# EAGLE board lpc1788_board (EAGLE 6.6.0)
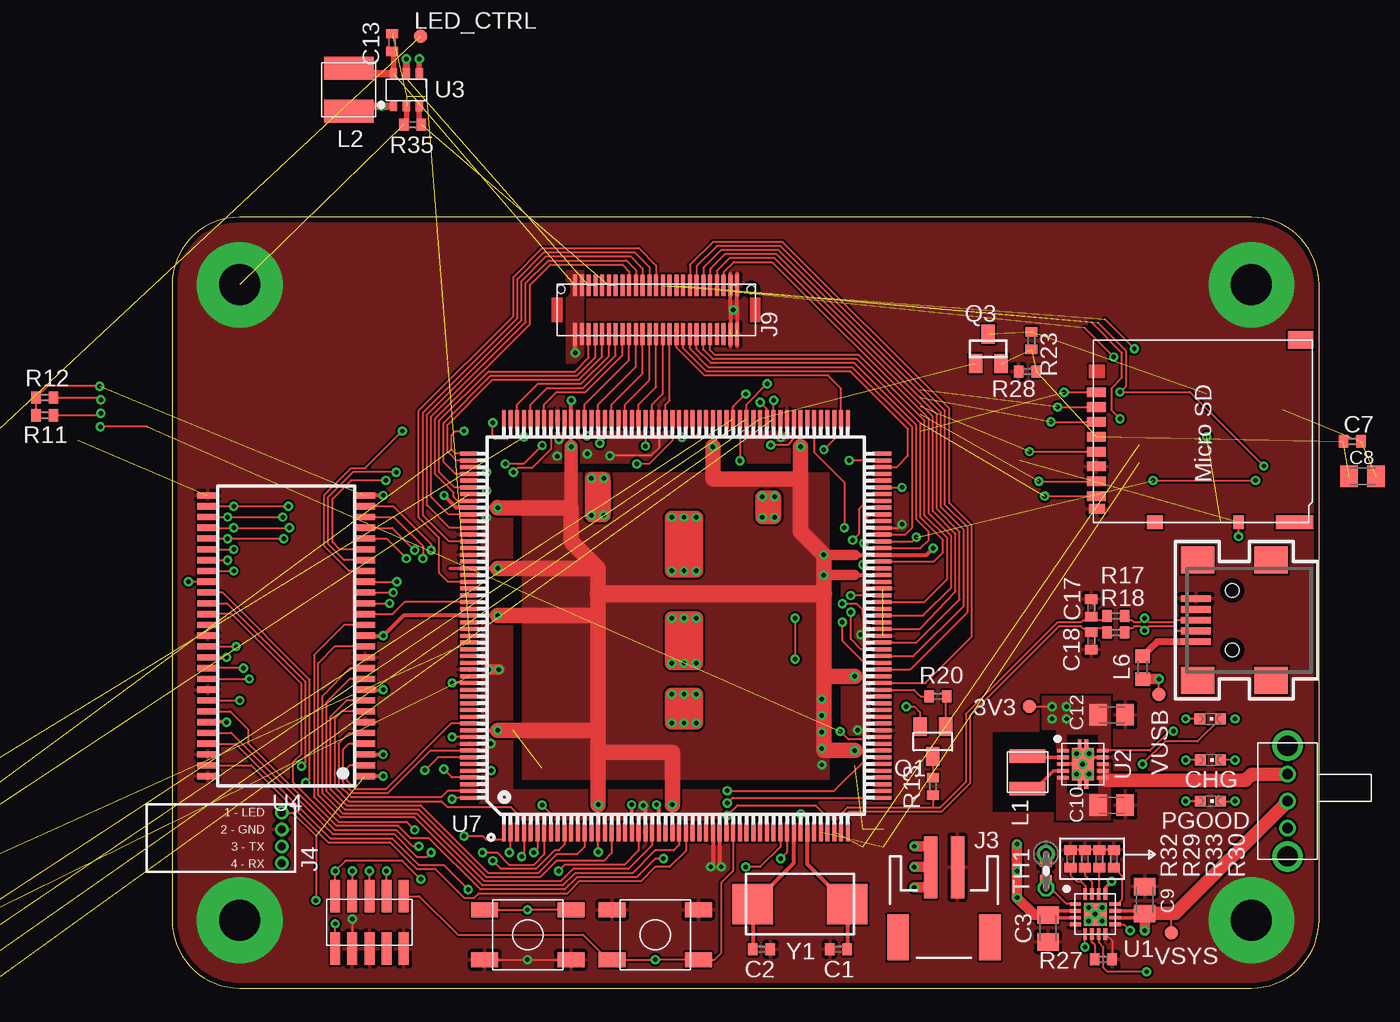
[diagram p5: board, top side]
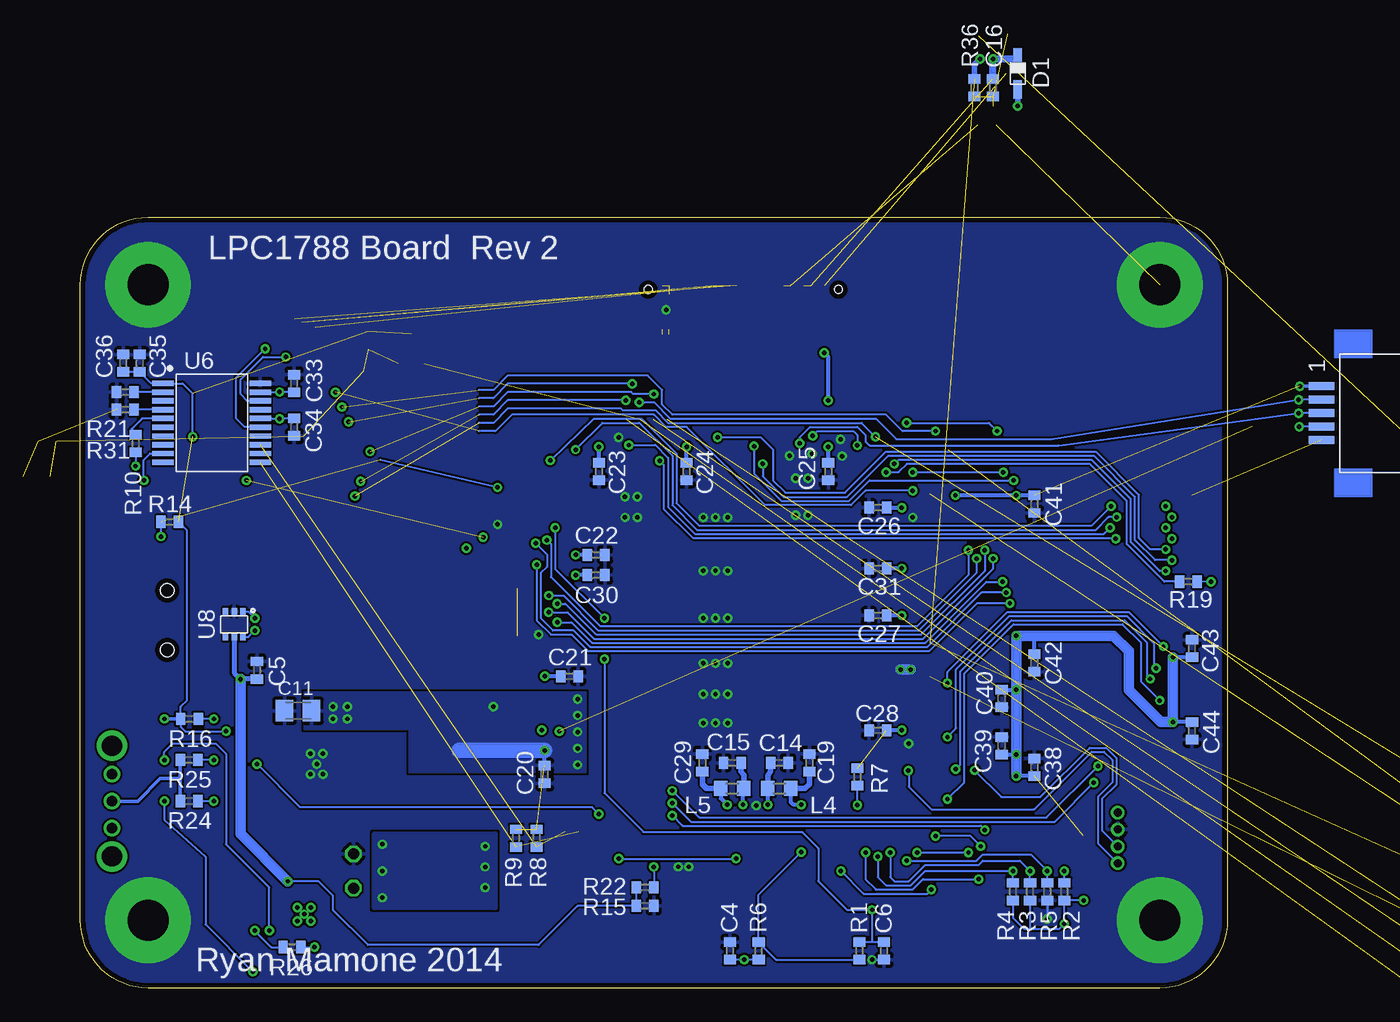
[diagram p6: board, bottom side, seen from below]

Size 85.01 x 57.15 mm. Coordinates in mm from the lower left corner, seen from the top.
Outline: 5.01,57.15 arc90 0,52.15 0,5.05 arc90 5.01,0 80.01,0 arc90 85.01,5.05 85.01,52.15 arc90 80.01,57.15 5.01,57.15
Copper layers (1*16): Top 0.0356mm / dielectric 1.5011mm / Bottom 0.0356mm
Design rules "LaenPCBOrder_tented_vias": minimum track width 6mil, minimum drill 13mil, track to track 6mil, track to pad 6mil, pad to pad 6mil, via to via 6mil, smd to smd 6mil, copper to edge 15mil, drill to drill 6mil, minimum pad ring 7mil, minimum via ring 7mil, stop-mask expansion 4mil, vias tented up to drill 13mil, thermal gap 10mil

## Footprints (pad centres in the part's own frame; a part is rotated, then mirrored left to right if it is on the bottom)
TP10R = smd 1 x 1: TP 0,0
C0402 = smd 0.7 x 0.9: 1 -0.65,0; 2 0.65,0
C0805K = smd 1.3 x 1.6: 1 -1,0; 2 1,0
CHIPLED_0603 = smd 0.8 x 0.8: A 0,-0.75; C 0,0.75
SOD-323 = smd 1.35 x 0.65: A 1.2,0; C -1.2,0
MUSB-05-X-B-SM-A = smd 0.5 x 2.25: 1 -1.6,8.545; 2 -0.8,8.545; 3 0,8.545; 4 0.8,8.545; 5 1.6,8.545 | smd 2 x 2.5: 8 -4.45,2.97; 9 4.45,2.97; 10 -4.45,8.42; 11 4.45,8.42 | hole 1: -2.2,5.85; 2.2,5.85
JST_2MM_SMT = smd 1 x 4.6: 1 -1,-2.43; 2 1,-2.43 | smd 1.6 x 3.4: NC1 -3.4,2.77; NC2 3.4,2.77
4-PIN_1.25MM = drill 0.6 pad 1: 1 1.875,0; 2 0.625,0; 3 -0.625,0; 4 -1.875,0
10-PIN_5X2_.050IN_SMT = smd 2.4 x 0.74: P$1 -1.95,2.54; P$2 1.95,2.54; P$3 -1.95,1.27; P$4 1.95,1.27; P$5 -1.95,0; P$6 1.95,0; P$7 -1.95,-1.27; P$8 1.95,-1.27; P$9 -1.95,-2.54; P$10 1.95,-2.54
DF12B-50DX_25X2_0.5MM = smd 0.3 x 1.6: P$1 -6,-1.8; P$2 -6,1.8; P$3 -5.5,-1.8; P$4 -5.5,1.8; P$5 -5,-1.8; P$6 -5,1.8; P$7 -4.5,-1.8; P$8 -4.5,1.8; P$9 -4,-1.8; P$10 -4,1.8; P$11 -3.5,-1.8; P$12 -3.5,1.8; P$13 -3,-1.8; P$14 -3,1.8; P$15 -2.5,-1.8; P$16 -2.5,1.8; P$17 -2,-1.8; P$18 -2,1.8; P$19 -1.5,-1.8; P$20 -1.5,1.8; P$21 -1,-1.8; P$22 -1,1.8; P$23 -0.5,-1.8; P$24 -0.5,1.8; P$25 0,-1.8; P$26 0,1.8; P$27 0.5,-1.8; P$28 0.5,1.8; P$29 1,-1.8; P$30 1,1.8; P$31 1.5,-1.8; P$32 1.5,1.8; P$33 2,-1.8; P$34 2,1.8; P$35 2.5,-1.8; P$36 2.5,1.8; P$37 3,-1.8; P$38 3,1.8; P$39 3.5,-1.8; P$40 3.5,1.8; P$41 4,-1.8; P$42 4,1.8; P$43 4.5,-1.8; P$44 4.5,1.8; P$45 5,-1.8; P$46 5,1.8; P$47 5.5,-1.8; P$48 5.5,1.8; P$49 6,-1.8; P$50 6,1.8 | hole 0.6: -7.05,1.5; 7.05,1.5
MOLEX_527930570 = smd 0.6 x 1.9: P$1 -2,0; P$2 -1,0; P$3 0,0; P$4 1,0; P$5 2,0
3015 = smd 1 x 2.7: 1 -1.2,0; 2 1.2,0
4012 = smd 1.7 x 3.7: 1 -1.6,0; 2 1.6,0
0603 = smd 1 x 1.1: 1 -0.85,0; 2 0.85,0
OS102011MA1QS1 = drill 1.5: CASE@1 -4.1,0; CASE@2 4.1,0 | drill 0.8: P$1 -2,0; P$2 0,0; P$3 2,0
SOT23 = smd 1 x 1.4: 1 -0.95,-1.1; 2 0.95,-1.1; 3 0,1.1
SUPER-SOT3 = smd 1 x 1.4: 1 -0.95,-1.1; 2 0.95,-1.1; 3 0,1.1
R0402 = smd 0.7 x 0.9: 1 -0.65,0; 2 0.65,0
SMT_PUSHBUTTON = smd 2 x 1.1: P$1 -3.2,1.85; P$2 3.2,1.85; P$3 -3.2,-1.85; P$4 3.2,-1.85
0204V = drill 0.813 octagon: 1 -1.27,0; 2 1.27,0
QFN-16 = smd 0.85 x 0.28: 1 -1.475,0.75; 2 -1.475,0.25; 3 -1.475,-0.25; 4 -1.475,-0.75; 9 1.475,-0.75; 10 1.475,-0.25; 11 1.475,0.25; 12 1.475,0.75 | smd 0.28 x 0.85: 5 -0.75,-1.475; 6 -0.25,-1.475; 7 0.25,-1.475; 8 0.75,-1.475; 13 0.75,1.475; 14 0.25,1.475; 15 -0.25,1.475; 16 -0.75,1.475 | smd 1.7 x 1.7: PAD 0,0 | drill 0.33 pad 0.33: PAD@1 -0.5,0.5; PAD@2 0.5,0.5; PAD@3 0,0; PAD@4 -0.5,-0.5; PAD@5 0.5,-0.5
QFN-10 = smd 0.28 x 0.85: 1 -1,-1.475; 2 -0.5,-1.475; 3 0,-1.475; 4 0.5,-1.475; 5 1,-1.475; 6 1,1.475; 7 0.5,1.475; 8 0,1.475; 9 -0.5,1.475; 10 -1,1.475 | smd 2.4 x 1.65: PAD@1 0,0 | smd 0.7 x 0.28: PAD@2 -1.5,0.25; PAD@3 -1.5,-0.25; PAD@4 1.5,0.25; PAD@5 1.5,-0.25
SOT-26 = smd 0.55 x 0.8: 1 -0.95,-1.2; 2 0,-1.2; 3 0.95,-1.2; 4 0.95,1.2; 5 0,1.2; 6 -0.95,1.2
TSOP54-II = smd 1.51 x 0.458: P$1 -5.835,10.4; P$2 -5.835,9.6; P$3 -5.835,8.8; P$4 -5.835,8; P$5 -5.835,7.2; P$6 -5.835,6.4; P$7 -5.835,5.6; P$8 -5.835,4.8; P$9 -5.835,4; P$10 -5.835,3.2; P$11 -5.835,2.4; P$12 -5.835,1.6; P$13 -5.835,0.8; P$14 -5.835,0; P$15 -5.835,-0.8; P$16 -5.835,-1.6; P$17 -5.835,-2.4; P$18 -5.835,-3.2; P$19 -5.835,-4; P$20 -5.835,-4.8; P$21 -5.835,-5.6; P$22 -5.835,-6.4; P$23 -5.835,-7.2; P$24 -5.835,-8; P$25 -5.835,-8.8; P$26 -5.835,-9.6; P$27 -5.835,-10.4; P$28 5.835,-10.4; P$29 5.835,-9.6; P$30 5.835,-8.8; P$31 5.835,-8; P$32 5.835,-7.2; P$33 5.835,-6.4; P$34 5.835,-5.6; P$35 5.835,-4.8; P$36 5.835,-4; P$37 5.835,-3.2; P$38 5.835,-2.4; P$39 5.835,-1.6; P$40 5.835,-0.8; P$41 5.835,0; P$42 5.835,0.8; P$43 5.835,1.6; P$44 5.835,2.4; P$45 5.835,3.2; P$46 5.835,4; P$47 5.835,4.8; P$48 5.835,5.6; P$49 5.835,6.4; P$50 5.835,7.2; P$51 5.835,8; P$52 5.835,8.8; P$53 5.835,9.6; P$54 5.835,10.4
SSOP-20 = smd 1.6 x 0.4: P$1 -3.6,2.925; P$2 -3.6,2.275; P$3 -3.6,1.625; P$4 -3.6,0.975; P$5 -3.6,0.325; P$6 -3.6,-0.325; P$7 -3.6,-0.975; P$8 -3.6,-1.625; P$9 -3.6,-2.275; P$10 -3.6,-2.925; P$11 3.6,-2.925; P$12 3.6,-2.275; P$13 3.6,-1.625; P$14 3.6,-0.975; P$15 3.6,-0.325; P$16 3.6,0.325; P$17 3.6,0.975; P$18 3.6,1.625; P$19 3.6,2.275; P$20 3.6,2.925
LQFP208 = smd 1.4 x 0.29: 1 -15.3,12.75; 2 -15.3,12.25; 3 -15.3,11.75; 4 -15.3,11.25; 5 -15.3,10.75; 6 -15.3,10.25; 7 -15.3,9.75; 8 -15.3,9.25; 9 -15.3,8.75; 10 -15.3,8.25; 11 -15.3,7.75; 12 -15.3,7.25; 13 -15.3,6.75; 14 -15.3,6.25; 15 -15.3,5.75; 16 -15.3,5.25; 17 -15.3,4.75; 18 -15.3,4.25; 19 -15.3,3.75; 20 -15.3,3.25; 21 -15.3,2.75; 22 -15.3,2.25; 23 -15.3,1.75; 24 -15.3,1.25; 25 -15.3,0.75; 26 -15.3,0.25; 27 -15.3,-0.25; 28 -15.3,-0.75; 29 -15.3,-1.25; 30 -15.3,-1.75; 31 -15.3,-2.25; 32 -15.3,-2.75; 33 -15.3,-3.25; 34 -15.3,-3.75; 35 -15.3,-4.25; 36 -15.3,-4.75; 37 -15.3,-5.25; 38 -15.3,-5.75; 39 -15.3,-6.25; 40 -15.3,-6.75; 41 -15.3,-7.25; 42 -15.3,-7.75; 43 -15.3,-8.25; 44 -15.3,-8.75; 45 -15.3,-9.25; 46 -15.3,-9.75; 47 -15.3,-10.25; 48 -15.3,-10.75; 49 -15.3,-11.25; 50 -15.3,-11.75; 51 -15.3,-12.25; 52 -15.3,-12.75; 105 15.3,-12.75; 106 15.3,-12.25; 107 15.3,-11.75; 108 15.3,-11.25; 109 15.3,-10.75; 110 15.3,-10.25; 111 15.3,-9.75; 112 15.3,-9.25; 113 15.3,-8.75; 114 15.3,-8.25; 115 15.3,-7.75; 116 15.3,-7.25; 117 15.3,-6.75; 118 15.3,-6.25; 119 15.3,-5.75; 120 15.3,-5.25; 121 15.3,-4.75; 122 15.3,-4.25; 123 15.3,-3.75; 124 15.3,-3.25; 125 15.3,-2.75; 126 15.3,-2.25; 127 15.3,-1.75; 128 15.3,-1.25; 129 15.3,-0.75; 130 15.3,-0.25; 131 15.3,0.25; 132 15.3,0.75; 133 15.3,1.25; 134 15.3,1.75; 135 15.3,2.25; 136 15.3,2.75; 137 15.3,3.25; 138 15.3,3.75; 139 15.3,4.25; 140 15.3,4.75; 141 15.3,5.25; 142 15.3,5.75; 143 15.3,6.25; 144 15.3,6.75; 145 15.3,7.25; 146 15.3,7.75; 147 15.3,8.25; 148 15.3,8.75; 149 15.3,9.25; 150 15.3,9.75; 151 15.3,10.25; 152 15.3,10.75; 153 15.3,11.25; 154 15.3,11.75; 155 15.3,12.25; 156 15.3,12.75 | smd 0.29 x 1.4: 53 -12.75,-15.3; 54 -12.25,-15.3; 55 -11.75,-15.3; 56 -11.25,-15.3; 57 -10.75,-15.3; 58 -10.25,-15.3; 59 -9.75,-15.3; 60 -9.25,-15.3; 61 -8.75,-15.3; 62 -8.25,-15.3; 63 -7.75,-15.3; 64 -7.25,-15.3; 65 -6.75,-15.3; 66 -6.25,-15.3; 67 -5.75,-15.3; 68 -5.25,-15.3; 69 -4.75,-15.3; 70 -4.25,-15.3; 71 -3.75,-15.3; 72 -3.25,-15.3; 73 -2.75,-15.3; 74 -2.25,-15.3; 75 -1.75,-15.3; 76 -1.25,-15.3; 77 -0.75,-15.3; 78 -0.25,-15.3; 79 0.25,-15.3; 80 0.75,-15.3; 81 1.25,-15.3; 82 1.75,-15.3; 83 2.25,-15.3; 84 2.75,-15.3; 85 3.25,-15.3; 86 3.75,-15.3; 87 4.25,-15.3; 88 4.75,-15.3; 89 5.25,-15.3; 90 5.75,-15.3; 91 6.25,-15.3; 92 6.75,-15.3; 93 7.25,-15.3; 94 7.75,-15.3; 95 8.25,-15.3; 96 8.75,-15.3; 97 9.25,-15.3; 98 9.75,-15.3; 99 10.25,-15.3; 100 10.75,-15.3; 101 11.25,-15.3; 102 11.75,-15.3; 103 12.25,-15.3; 104 12.75,-15.3; 157 12.75,15.3; 158 12.25,15.3; 159 11.75,15.3; 160 11.25,15.3; 161 10.75,15.3; 162 10.25,15.3; 163 9.75,15.3; 164 9.25,15.3; 165 8.75,15.3; 166 8.25,15.3; 167 7.75,15.3; 168 7.25,15.3; 169 6.75,15.3; 170 6.25,15.3; 171 5.75,15.3; 172 5.25,15.3; 173 4.75,15.3; 174 4.25,15.3; 175 3.75,15.3; 176 3.25,15.3; 177 2.75,15.3; 178 2.25,15.3; 179 1.75,15.3; 180 1.25,15.3; 181 0.75,15.3; 182 0.25,15.3; 183 -0.25,15.3; 184 -0.75,15.3; 185 -1.25,15.3; 186 -1.75,15.3; 187 -2.25,15.3; 188 -2.75,15.3; 189 -3.25,15.3; 190 -3.75,15.3; 191 -4.25,15.3; 192 -4.75,15.3; 193 -5.25,15.3; 194 -5.75,15.3; 195 -6.25,15.3; 196 -6.75,15.3; 197 -7.25,15.3; 198 -7.75,15.3; 199 -8.25,15.3; 200 -8.75,15.3; 201 -9.25,15.3; 202 -9.75,15.3; 203 -10.25,15.3; 204 -10.75,15.3; 205 -11.25,15.3; 206 -11.75,15.3; 207 -12.25,15.3; 208 -12.75,15.3
SC-88 = smd 0.5 x 0.4: P$1 -0.95,0.65; P$2 -0.95,0; P$3 -0.95,-0.65; P$4 0.95,-0.65; P$5 0.95,0; P$6 0.95,0.65
DM3AT = smd 1 x 1.2: CASE -6.785,2.28 | smd 1 x 2.8: CASE@1 -6.785,-8.07 | smd 1.3 x 1.9: CASE@2 6.715,-8.52 | smd 0.711 x 1.422: CD/DAT3 1.74,6.63; CLK -1.56,6.63; CMD 0.64,6.63; DAT0 -3.76,6.63; DAT1 -4.86,6.63; DAT2 2.84,6.63; VDD -0.46,6.63; VSS -2.66,6.63 | smd 1 x 0.8: DET_A -6.785,-3.92 | smd 0.7 x 1.2: DET_B -5.81,6.58
2-SMD_8MMX4.5MM = smd 3 x 3: 1 -3.5,0; 2 3.5,0

## Placement (x,y rotation side)
3V3  TPTP10R  [TP10R]  63.55,20.88 0 top
C1  18pF  [C0402]  49.4,2.9 180 top
C2  18pF  [C0402]  43.7,2.9 0 top
C3  10uF  [C0805K]  64.92,4.43 270 top
C4  0.1uF  [C0402]  36.88,2.76 90 bottom
C5  1uF  [C0402]  71.93,23.57 90 bottom
C6  0.1uF  [C0402]  25.45,2.76 270 bottom
C7  0.1uF  [C0402]  87.48,40.54 0 top
C8  10uF  [C0805K]  88.24,37.95 0 top
C9  10uF  [C0805K]  72.09,6.54 90 top
C10  10uF  [C0805K]  69.65,13.56 0 top
C11  10uF  [C0805K]  68.88,20.57 180 bottom
C12  10uF  [C0805K]  69.65,20.27 0 top
C13  1uF  [C0402]  16.31,70.1 90 top  (outside the outline)
C14  0.1uF  [C0402]  33.21,16.71 0 bottom
C15  0.1uF  [C0402]  36.7,16.71 180 bottom
C16  1uF  [C0402]  17.37,66.75 270 bottom  (outside the outline)
C17  18pF  [C0402]  68.12,28.19 90 top
C18  18pF  [C0402]  68.12,25.76 270 top
C19  0.1uF  [C0402]  30.99,16.71 90 bottom
C20  0.1uF  [C0402]  50.61,15.85 270 bottom
C21  0.1uF  [C0402]  48.77,23.12 0 bottom
C22  0.1uF  [C0402]  46.79,32.12 0 bottom
C23  0.1uF  [C0402]  46.59,38.3 270 bottom
C24  0.1uF  [C0402]  40.09,38.3 270 bottom
C25  0.1uF  [C0402]  29.59,38.3 270 bottom
C26  0.1uF  [C0402]  25.91,35.62 180 bottom
C27  0.1uF  [C0402]  25.91,27.62 180 bottom
C28  0.1uF  [C0402]  25.91,19.12 180 bottom
C29  0.1uF  [C0402]  38.93,16.71 90 bottom
C30  0.1uF  [C0402]  46.79,30.62 0 bottom
C31  0.1uF  [C0402]  25.91,31.12 180 bottom
C33  0.01uF  [C0402]  69.18,44.84 90 bottom
C34  0.01uF  [C0402]  69.17,41.59 270 bottom
C35  0.1uF  [C0402]  80.62,46.33 90 bottom
C36  10uF  [C0402]  81.84,46.33 90 bottom
C38  0.1uF  [C0402]  14.3,16.38 90 bottom
C39  0.1uF  [C0402]  16.74,17.98 90 bottom
C40  0.1uF  [C0402]  16.74,21.48 270 bottom
C41  0.1uF  [C0402]  14.3,35.88 270 bottom
C42  0.1uF  [C0402]  14.3,24.11 270 bottom
C43  0.1uF  [C0402]  2.63,25.18 90 bottom
C44  0.1uF  [C0402]  2.63,19.08 270 bottom
CHG  USB  [CHIPLED_0603]  76.96,16.92 270 top
D1  [SOD-323]  15.54,67.82 270 bottom  (outside the outline)
J2  SAMTEC_MUSB  [MUSB-05-X-B-SM-A]  84.43,27.28 90 top
J3  JST_2MM_SMT  [JST_2MM_SMT]  57.22,6.53 180 top
J4  Console  [4-PIN_1.25MM]  8.13,11.14 90 top
J6  JTAG  [10-PIN_5X2_.050IN_SMT]  14.63,4.88 90 top
J9  DF12B-50DX_25X2_0.5MM  [DF12B-50DX_25X2_0.5MM]  35.88,50.29 0 top
J10  MOLEX_527930570_5PIN_FFC_CONNECTOR  [MOLEX_527930570]  -6.97,42.62 270 bottom  (outside the outline)
L1  3.3uH  [3015]  63.4,16 90 top
L2  22uH  [4012]  13.11,66.6 270 top  (outside the outline)
L4  470nH  [0603]  33.21,14.81 180 bottom
L5  470nH  [0603]  36.7,14.81 0 bottom
L6  470nH  [0603]  71.93,23.77 270 top
LED2  USB  [CHIPLED_0603]  76.94,19.96 270 top
LED_CTRL  TPTP10R  [TP10R]  18.44,70.56 0 top  (outside the outline)
PGOOD  USB  [CHIPLED_0603]  76.96,13.87 270 top
PWR  OS102011MA1QS1  [OS102011MA1QS1]  82.69,13.87 90 top
Q1  MMBT2907  [SOT23]  56.39,18.29 180 top
Q3  FDN335N  [SUPER-SOT3]  60.5,47.4 0 top
R1  100K  [R0402]  27.28,2.76 270 bottom
R2  10K  [R0402]  12.09,7.16 270 bottom
R3  10K  [R0402]  14.63,7.16 270 bottom
R4  10K  [R0402]  15.9,7.16 270 bottom
R5  10K  [R0402]  13.36,7.16 90 bottom
R6  100K  [R0402]  34.75,2.76 90 bottom
R7  10K  [R0402]  27.43,15.66 90 bottom
R8  4.7K  [R0402]  51.21,11.13 90 bottom
R9  4.7K  [R0402]  52.73,11.13 90 bottom
R10  20K  [R0402]  80.92,40.39 270 bottom
R11  4.7K  [R0402]  -9.45,42.47 180 top  (outside the outline)
R12  4.7K  [R0402]  -9.45,43.77 180 top  (outside the outline)
R13  1.5K  [R0402]  56.39,14.98 90 top
R14  10K  [R0402]  78.4,34.57 180 bottom
R15  39K  [R0402]  43.17,6.1 180 bottom
R16  50  [R0402]  76.94,19.96 180 bottom
R17  33  [R0402]  69.95,27.58 180 top
R18  33  [R0402]  69.95,26.37 180 top
R19  0  [R0402]  2.89,30.14 0 bottom
R20  22  [R0402]  56.76,21.64 0 top
R21  20K  [R0402]  81.69,44.19 0 bottom
R22  24K  [R0402]  43.17,7.47 180 bottom
R23  0  [R0402]  63.7,48.01 270 top
R24  1.5K  [R0402]  76.96,13.87 180 bottom
R25  1.5K  [R0402]  76.96,16.92 180 bottom
R26  10K  [R0402]  69.34,3.05 0 bottom
R27  10K  [R0402]  69.04,2.13 180 top
R28  10K  [R0402]  63.4,45.72 180 top
R29  3.57K  [R0402]  67.67,9.6 270 top
R30  2.94K  [R0402]  69.8,9.6 270 top
R31  20K  [R0402]  81.69,42.88 0 bottom
R32  4.32K  [R0402]  66.6,9.6 270 top
R33  56.2K  [R0402]  68.73,9.6 270 top
R34  10K  [R0402]  64.77,8.69 90 top
R35  2.5  [R0402]  17.83,64.01 0 top  (outside the outline)
R36  10K  [R0402]  18.75,66.75 90 bottom  (outside the outline)
SW1  Reset  [SMT_PUSHBUTTON]  35.81,3.96 180 top
SW3  ISP  [SMT_PUSHBUTTON]  26.37,3.96 0 top
TH1  [0204V]  64.77,8.69 270 top
TP1  TPTP10R  [TP10R]  -78.18,-36.27 0 top  (outside the outline)
TP2  TPTP10R  [TP10R]  -78.18,-39.62 0 top  (outside the outline)
TP3  TPTP10R  [TP10R]  -78.18,-42.98 0 top  (outside the outline)
TP4  TPTP10R  [TP10R]  -78.18,-19.51 0 top  (outside the outline)
TP5  TPTP10R  [TP10R]  -78.18,-22.86 0 top  (outside the outline)
TP6  TPTP10R  [TP10R]  -78.18,-26.21 0 top  (outside the outline)
TP7  TPTP10R  [TP10R]  -78.18,-29.57 0 top  (outside the outline)
TP8  TPTP10R  [TP10R]  -78.18,-32.92 0 top  (outside the outline)
TP9  TPTP10R  [TP10R]  -78.18,-46.33 0 top  (outside the outline)
TP10  TPTP10R  [TP10R]  -78.18,-49.68 0 top  (outside the outline)
U1  BQ24232H-BATTERY_CHARGER  [QFN-16]  68.43,5.49 0 top
U2  TPS63001-BUCK-BOOST_CONVERTER  [QFN-10]  67.51,16.61 270 top
U3  AP5724  [SOT-26]  17.37,66.6 0 top  (outside the outline)
U4  AS4C8M16S-128MBIT_SDRAM  [TSOP54-II]  8.47,26.13 180 top
U6  AR1021-RESISTIVE_TOUCH_CONTROLLER  [SSOP-20]  75.29,41.91 0 bottom
U7  LPC177X_8X-208  [LQFP208]  37.34,26.87 90 top
U8  NUP2202  [SC-88]  73.61,26.97 270 bottom
U$3  DM3AT  [DM3AT]  75.13,41.34 90 top
VSYS  TPTP10R  [TP10R]  74.07,4.11 0 top
VUSB  TPTP10R  [TP10R]  73.15,21.79 0 top
Y1  12MHz  [2-SMD_8MMX4.5MM]  46.55,6.24 0 top

## Tracks (layer width: path | path; a pad name or v marks a point on that pad's centre or on a via)
!CAS  (via drill 0.33)
  Top 0.152: U7.87 51.48,31.12 v51.21,31.39 | U4.P$17 v16.13,28.53
  Bottom 0.152: v16.13,28.53 18.56,28.53 22.1,24.99 47.4,24.99 48.62,26.21 50.14,26.21 51.21,27.28 v51.21,31.39
!DYCS0  (via drill 0.33)
  Top 0.152: U7.73 51.31,24.12 49.68,25.76 v49.68,27.13 | U4.P$19 v16.66,30.13
  Bottom 0.152: v49.68,27.13 48.62,27.13 47.09,25.6 22.4,25.6 17.88,30.13 v16.66,30.13
!RAS  (via drill 0.33)
  Top 0.152: v51.28,32.99 51.28,34.67 51.73,35.12 U7.95 | U4.P$18 v16.39,29.33
  Bottom 0.152: v51.28,32.99 50.44,32.16 50.44,31.24 50.9,30.79 50.9,27.43 49.99,26.52 48.46,26.52 47.24,25.3 22.25,25.3 18.22,29.33 v16.39,29.33
!WE
  Top 0.152: U7.179 17.25,28.62 16.35,27.73 U4.P$16
+3V3  (via drill 0.33)  (10 unrouted)
  Top 0.152: v-5.37,44.62 -9.22,44.62 R12.2 R11.2 | v31.59,10.1 U7.15 | 48.34,17.63 48.31,17.65 | J6.P$1 v12.09,4.78 | 8.13,13.01 8.94,13.01 10.67,11.28 v10.67,6.51 | v54.41,20.88 55.02,20.88 55.44,20.46 Q1.2 | v74.22,19.05 73.91,19.05 72.48,17.61 U2.10 | 3V3.TP v65.23,20.88
  Top 0.254: 20.61,31.12 U7.174
  Top 0.279: U7.15 v31.59,13.59 | U7.26 v37.08,13.59 | U7.198 v24.13,19.12 | v24.13,27.62 U7.181 17.15,27.62 v15.65,26.13 U4.P$14 | v24.13,31.12 U7.174 | v24.13,35.62 U7.165 21.07,35.62 v20.16,36.53 | v29.59,40.14 U7.146 v29.59,43.56 | v40.09,40.14 U7.125 | v46.59,40.14 U7.112 | v48.31,32.12 U7.89 55.93,32.12 v56.42,32.61 | v48.31,30.62 U7.86 | v50.61,23.12 U7.71 | v50.61,17.62 U7.60 | C38.1 v15.65,15.73 | U4.P$3 v15.65,17.33 | U4.P$9 v15.65,22.13 | C43.1 v4.05,24.53 | v4.05,19.73 C44.1 | v15.65,36.53 C41.1 | v29.88,47.09 J9.P$1
  Top 0.3: U7.26
  Top 0.406: U3.6 16.42,69.34 C13.1
  Top 0.559: U3.6 13.41,67.8
  Top 0.61: 50.6,32.13 v48.31,32.12 | 13.41,67.8 L2.1
  Top 0.762: 50.6,30.63 v48.31,30.62 | v48.31,32.13 50.6,32.13
  Top 1.016: v29.59,40.14 29.59,35.61
  Top 1.143: v37.08,13.59 37.08,17.48 31.59,17.48 | v24.13,19.12 v24.13,19.13 31.59,19.13 | v31.59,13.59 31.59,17.48 | v24.13,35.62 24.14,35.61 29.59,35.61 29.59,33.12 31.59,31.12 | 46.58,37.74 40.13,37.74 40.08,37.8 v40.08,40.13 v40.09,40.14 | 46.58,37.74 46.58,33.86 v48.31,32.13 | v50.61,17.62 48.34,17.62 48.34,17.63 | 46.58,37.74 v46.58,40.14 v46.59,40.14 | v24.13,27.62 31.59,27.62 | v24.13,31.12 31.59,31.12 | 31.59,19.13 31.59,17.48 | 31.59,27.62 31.59,19.13 | 31.59,31.12 31.59,29.26 31.59,27.62 | v50.61,23.12 48.31,23.12 | 48.31,23.12 48.31,17.65 | 48.31,23.12 48.31,29.26 v48.31,30.62 v48.31,32.12
  Top 1.27: 31.59,29.26 48.31,29.26
  Bottom 0.152: C36.1 C35.1 79.78,44.84 U6.P$1 77.45,44.84 76.69,44.08 v76.69,40.88 | R4.2 15.9,5.23 15.09,4.42 14.63,4.42 | 14.63,4.42 12.45,4.42 v12.09,4.78 R2.2 v10.67,6.51 | R3.2 14.63,4.42 | v31.59,10.1 34.75,6.94 R6.2 33.45,2.11 R1.2 | R16.2 77.57,19.98 | 77.57,19.98 77.57,19.36 77.27,19.05 v74.22,19.05 | 77.57,19.98 77.57,20.88 77.11,21.34 77.11,33.94 R14.1
  Bottom 0.254: R16.2 v78.79,19.96 | J10.P$1 v-5.37,44.62
  Bottom 0.279: C38.1 v15.65,15.73 | C39.1 v15.65,17.33 | C40.1 v15.65,22.13 | C42.1 U4.P$14 | C41.1 v15.65,36.53 v20.16,36.53 | C43.1 v4.05,24.53 | C44.1 v4.05,19.73 | v29.59,43.56 29.59,46.8 v29.88,47.09
  Bottom 0.3: v24.13,19.12 C28.1 | 25.25,27.64 C27.1 v24.13,27.62 | v24.13,31.12 C31.1 | C26.1 v24.13,35.62 | C25.1 v29.59,40.14 | C24.1 v40.09,40.14 | C23.1 v46.59,40.14 | C22.1 v48.31,32.12 | C30.1 v48.31,30.62 | C21.1 v50.61,23.12 | C20.1 v50.61,17.62 | L5.1 37.55,14.06 v37.08,13.59 | v31.59,13.59 32.16,13.59 32.36,13.79 L4.1
  Bottom 0.406: L5.1 38.61,14.81 38.92,15.13 C29.1 | L4.1 31.3,14.81 30.99,15.13 C19.1
  Bottom 0.762: v15.65,15.73 v15.65,17.33 v15.65,22.13 v15.65,26.13 U4.P$14 8.45,26.13 7.32,24.99 7.32,22.1 4.95,19.73 v4.05,19.73 v4.05,24.53
  Bottom 1.143: 56.94,17.62 v50.61,17.62
  other vias: 66.29,19.96 66.29,20.88 48.17,21.43 48.17,20.21 48.17,18.99 48.17,17.78 48.17,16.56 65.23,19.96
  pour Top: 25.93,15.42 48.79,15.42 48.79,38.28 25.93,38.28
  cutout Top (rank 2): 39.9,11.3 40.87,11.3 40.87,11.81 39.9,11.81
  pour Top (no thermals): 29.26,53.19 30.48,53.19 30.48,46.86 29.87,46.33 29.26,46.33
  cutout Top (rank 2): 41.27,48.18 41.94,48.18 41.94,48.69 41.27,48.69
  cutout Top (rank 2): 41.27,51.84 41.94,51.84 41.94,52.35 41.27,52.35
  pour Top (rank 2, no thermals): 64.52,21.64 69.55,21.64 69.55,17.51 65.58,17.51 65.58,19.2 64.52,19.2
  pour Bottom (rank 2): 68.43,19.2 60.66,19.2 60.66,16 47.55,16 47.55,21.95 68.43,21.95
+VUSB  (via drill 0.33)
  Top 0.152: VUSB.TP v73.15,22.92
  Top 0.254: U1.13 69.18,7.46 v69.65,7.92
  Top 0.762: C5.1 v73.15,22.92
  Bottom 0.152: v69.65,7.92 67.36,7.92 66.29,6.86 66.29,5.79 63.7,3.2 51.05,3.2 48.16,6.1 R15.2 R22.2
  Bottom 0.381: U8.P$5 73.61,23.38 v73.15,22.92 C5.1
  Bottom 0.762: v69.65,7.92 73.15,11.43 v73.15,22.92
/RESET  (via drill 0.33)
  Top 0.152: U7.35 41.59,8.69 40.69,7.8 40.69,2.59 40.21,2.11 SW1.P$1 v35.81,2.11 SW1.P$2 32.33,2.11 30.48,3.96 21.18,3.96 18.32,6.83 J6.P$10
  Bottom 0.152: R6.1 v35.81,2.11 C4.1
/RESET1  (via drill 0.33)
  Top 0.152: U7.110 47.59,39.74 49.84,37.49 v49.84,34.14 | SW3.P$1 v26.34,5.81 SW3.P$2 | v46.18,27.43 v46.18,24.38
  Bottom 0.152: C6.1 26.36,3.41 | 26.36,3.41 R1.1 | 26.36,3.41 26.34,3.43 v26.34,5.81 28.21,5.81 30.33,7.92 30.33,10.36 31.55,11.58 43.28,11.58 46.18,14.48 v46.18,24.38 | v49.84,34.14 49.84,31.09 v46.18,27.43
A0  (via drill 0.33)
  Top 0.152: U7.75 51.08,25.12 50.31,25.89 v50.31,27.87 | U4.P$23 15.9,33.33 v17.37,31.85
  Bottom 0.152: v50.31,27.87 48.9,27.87 46.94,25.91 22.55,25.91 17.37,31.09 v17.37,31.85
A1  (via drill 0.33)
  Top 0.152: U7.79 51.67,27.12 51.21,27.58 51.21,28.04 50.75,28.5 v49.68,28.5 | U4.P$24 16.32,34.13 v17.98,32.46
  Bottom 0.152: v49.68,28.5 49.07,28.5 46.79,26.21 22.71,26.21 17.98,30.94 v17.98,32.46
A2  (via drill 0.33)
  Top 0.152: U7.83 52.62,29.11 v50.29,29.11 | U4.P$25 16.43,34.93 18.59,32.77 v18.59,31.85
  Bottom 0.152: v50.29,29.11 49.23,29.11 46.63,26.52 22.86,26.52 18.59,30.79 v18.59,31.85
A3  (via drill 0.33)
  Top 0.152: v50.44,33.22 50.9,33.68 50.9,35.51 51.52,36.12 U7.97 | U4.P$26 16.39,35.73 19.2,32.92 v19.2,32.46
  Bottom 0.152: v50.44,33.22 50.14,32.92 50.14,30.48 46.48,26.82 23.01,26.82 19.2,30.63 v19.2,32.46
A4  (via drill 0.33)
  Top 0.152: U4.P$29 v4.57,35.73 v8.62,35.73 | U7.103 v50.18,39.12
  Bottom 0.152: v50.18,39.12 46.94,42.22 43.43,42.22 40.84,39.62 40.84,35.97 39.17,34.29 10.06,34.29 v8.62,35.73
A5  (via drill 0.33)
  Top 0.152: U4.P$30 v4.12,34.93 v8.2,34.93 | U7.107 49.09,40.71 v48.31,39.93
  Bottom 0.152: v48.31,39.93 46.33,41.91 43.59,41.91 41.15,39.47 41.15,35.81 39.32,33.98 9.75,33.98 8.81,34.93 v8.2,34.93
A6  (via drill 0.33)
  Top 0.152: U7.113 46.09,40.84 45.67,40.27 v44.38,40.27 | U4.P$31 v4.57,34.13 v8.7,34.13
  Bottom 0.152: v44.38,40.27 42.4,40.27 41.45,39.32 41.45,35.66 39.47,33.68 9.14,33.68 v8.7,34.13
A7  (via drill 0.33)
  Top 0.152: U7.121 v42.09,39.09 | U4.P$32 v4.12,33.33 v8.28,33.33
  Bottom 0.152: v8.28,33.33 8.33,33.33 8.38,33.38 39.62,33.38 41.78,35.53 41.78,38.79 v42.09,39.09
A8  (via drill 0.33)
  Top 0.152: U7.127 39.09,41.22 38.71,40.84 v37.8,40.84 | U4.P$33 v4.57,32.53
  Bottom 0.152: v37.8,40.84 34.59,40.84 33.68,39.93 33.68,37.64 32.77,36.73 28.35,36.73 25.3,39.78 9.75,39.78 6.55,36.58 6.55,33.38 5.71,32.53 v4.57,32.53
A9  (via drill 0.33)
  Top 0.152: U7.131 37.09,40.59 35.36,38.86 v34.44,38.86 | U4.P$34 v4.12,31.73
  Bottom 0.152: v34.44,38.86 34.44,37.95 32.92,36.42 28.19,36.42 25.15,39.47 9.91,39.47 6.86,36.42 6.86,33.22 5.36,31.73 v4.12,31.73
A10  (via drill 0.33)
  Top 0.152: U7.135 v35.09,40.18 | U4.P$22 12.43,32.53 11.89,33.07 11.89,36.27 13.26,37.64 v15.85,37.64
  Bottom 0.152: v35.09,40.18 35.09,38.14 33.07,36.12 28.04,36.12 26.52,37.64 v15.85,37.64
A11  (via drill 0.33)
  Top 0.152: v30.73,40.95 30.38,40.95 30.09,41.23 U7.145 | U4.P$35 v4.57,30.93 | v27.43,40.23 26.06,38.86 v24.69,38.86
  Bottom 0.152: v24.69,38.86 24.38,39.17 10.06,39.17 7.16,36.27 7.16,33.07 5.02,30.93 v4.57,30.93 v4.56,30.93 | v30.73,40.95 30.38,41.3 27.74,41.3 27.43,41 v27.43,40.23
A12  (via drill 0.33)
  Top 0.152: U7.149 28.09,39.98 26.67,38.56 25.6,38.56 v25.3,38.25
  Bottom 0.152: v25.3,38.25 24.38,38.25 23.77,38.86 10.21,38.86 7.47,36.12 7.47,32.92 4.69,30.14 R19.1
A13  (via drill 0.33)
  Top 0.152: U7.155 25.09,40.94 24.84,40.69 23.93,40.69 23.77,40.84 v23.77,41.91 | U4.P$20 13.12,30.93 11.28,32.77 11.28,36.58 13.26,38.56 14.33,38.56 v17.07,41.3
  Bottom 0.152: v23.77,41.91 17.68,41.91 v17.07,41.3
A14  (via drill 0.33)
  Top 0.152: U7.159 23.1,38.62 23.32,38.41 v23.32,38.25 | U4.P$21 12.77,31.73 11.58,32.92 11.58,36.42 13.41,38.25 v16.61,38.25
  Bottom 0.152: v23.32,38.25 v16.61,38.25
B0
  Top 0.152: U7.160 21.01,38.12 20.12,39.01 20.12,41.91 23.62,45.41 30.02,45.41 31.38,46.77 J9.P$7
B1
  Top 0.152: U7.158 21.07,39.12 20.42,39.78 20.42,41.76 23.77,45.11 30.18,45.11 31.88,46.82 J9.P$9
B2
  Top 0.152: U7.106 49.59,44.44 48.62,45.41 39.47,45.41 37.38,47.5 J9.P$31
B3
  Top 0.152: U7.102 53.71,38.62 54.56,39.47 54.56,41.45 50.29,45.72 39.62,45.72 37.88,47.46 J9.P$33
B4
  Top 0.152: U7.82 55.75,28.62 57.45,30.33 57.45,33.38 55.78,35.05 55.78,42.06 50.9,46.94 40.23,46.94 39.88,47.29 J9.P$41
B5
  Top 0.152: U7.88 56.46,31.62 57.15,32.31 57.15,33.22 55.47,34.9 55.47,41.91 50.75,46.63 40.08,46.63 39.38,47.33 J9.P$39
B6
  Top 0.152: U7.90 55.48,32.62 56.08,33.22 56.08,33.83 55.17,34.75 55.17,41.76 50.6,46.33 39.93,46.33 38.88,47.38 J9.P$37
B7
  Top 0.152: U7.92 54.35,33.62 54.86,34.14 54.86,41.6 50.44,46.02 39.78,46.02 38.38,47.42 J9.P$35
CKE  (via drill 0.33)
  Top 0.152: v41.15,13.72 41.55,14.12 U7.53 | v9.91,15.24 10.21,15.54 10.21,22.86 3.74,29.33 U4.P$37
  Bottom 0.152: v41.15,13.72 39.78,12.34 12.8,12.34 v9.91,15.24
CLK  (via drill 0.33)
  Top 0.152: U7.59 51.57,17.12 49.07,14.63 v41.15,14.63 | v9.6,16.46 9.91,16.76 9.91,22.71 4.09,28.53 U4.P$38
  Bottom 0.152: v41.15,14.63 39.17,12.65 13.41,12.65 v9.6,16.46
D0
  Top 0.152: U4.P$2 13.18,16.53 12.95,16.31 12.95,15.39 13.56,14.78 15.85,14.78 20.69,19.62 U7.197
D1
  Top 0.152: U4.P$4 13.1,18.13 12.65,17.68 12.65,15.24 13.41,14.48 16,14.48 19.15,17.62 U7.201
D2
  Top 0.152: U4.P$5 14.33,18.9 13.11,18.9 12.34,18.14 12.34,15.09 13.26,14.17 19.96,14.17 20.41,14.62 U7.207
D3
  Top 0.152: U4.P$7 12.6,20.53 12.04,19.96 12.04,14.94 13.11,13.87 19.96,13.87 20.42,13.41 25.15,13.41 25.59,12.97 U7.3
D4
  Top 0.152: U7.13 30.59,10.47 30.02,9.91 28.5,9.91 27.13,8.53 23.47,8.53 18.44,13.56 12.95,13.56 11.73,14.78 11.73,20.12 12.95,21.33 U4.P$8
D5
  Top 0.152: U7.17 32.59,10.03 32,9.45 28.5,9.45 27.28,8.23 23.32,8.23 18.29,13.26 12.8,13.26 11.43,14.63 11.43,21.18 13.17,22.93 U4.P$10
D6
  Top 0.152: U7.23 35.59,10.59 33.83,8.84 29.72,8.84 28.8,7.92 23.16,7.92 18.14,12.95 12.65,12.95 11.12,14.48 11.12,21.64 13.21,23.73 U4.P$11
D7
  Top 0.152: U7.27 37.59,10.61 37.19,10.21 35.81,10.21 34.14,8.53 29.87,8.53 28.96,7.62 23.01,7.62 17.98,12.65 12.5,12.65 10.82,14.33 10.82,24.08 12.07,25.33 U4.P$13
D8  (via drill 0.33)
  Top 0.152: U7.191 v20.76,22.62 | U4.P$42 v4.75,25.33
  Bottom 0.152: v20.76,22.62 20.76,23.44 16.31,27.89 7.32,27.89 v4.75,25.33
D9  (via drill 0.33)
  Top 0.152: U7.199 v20.76,18.62 | v5.29,23.73 U4.P$44
  Bottom 0.152: v20.76,18.62 20.12,19.26 20.12,23.62 16.15,27.58 7.47,27.58 5.44,25.56 5.44,23.88 v5.29,23.73
D10  (via drill 0.33)
  Top 0.152: U4.P$45 v5.72,22.93 | U7.205 20.76,15.62 v20.15,16.23
  Bottom 0.152: v20.15,16.23 19.81,16.57 19.81,23.47 16,27.28 7.62,27.28 5.94,25.6 5.94,23.15 v5.72,22.93
D11  (via drill 0.33)
  Top 0.152: U7.208 20.86,14.12 v20.76,14.02 | U4.P$47 v5.02,21.33
  Bottom 0.152: v20.76,14.02 19.51,15.27 19.51,23.32 15.85,26.98 7.77,26.98 6.4,25.6 6.4,22.71 v5.02,21.33
D12  (via drill 0.33)
  Top 0.152: U7.1 24.59,11.02 23.27,11.02 23.01,11.28 v21.64,11.28 | U4.P$48 4.31,20.53 5.64,19.2 5.64,18.14 12.04,11.73 16.61,11.73 17.83,10.52 v18.29,10.52
  Bottom 0.152: v18.29,10.52 19.05,11.28 v21.64,11.28
D13  (via drill 0.33)
  Top 0.152: U7.7 27.59,9.91 26.82,9.14 24.99,9.14 24.08,10.06 v23.01,10.06 | U4.P$50 4.39,18.93 11.89,11.43 16.46,11.43 18.14,9.75 18.9,9.75 v19.2,10.06
  Bottom 0.152: v23.01,10.06 v19.2,10.06
D14  (via drill 0.33)
  Top 0.152: U7.21 34.59,10.2 33.53,9.14 29.11,9.14 v28.65,8.69 | U4.P$51 4.73,18.13 11.73,11.12 16.31,11.12 18.29,9.14 20.12,9.14 v21.95,7.32
  Bottom 0.152: v28.65,8.69 26.98,7.01 22.25,7.01 v21.95,7.32
D15
  Top 0.152: U7.28 38.09,10.2 36.88,8.99 35.81,8.99 34.75,7.92 30.18,7.92 29.26,7.01 22.71,7.01 22.4,6.71 21.64,6.71 19.51,8.84 18.14,8.84 16.15,10.82 11.58,10.82 5.88,16.53 U4.P$53
D_N  (via drill 0.33)
  Top 0.152: J2.2 74.56,26.48 74.22,26.82 72.39,26.82 v72.08,26.52 71.78,26.82 71.32,26.82 71.17,26.67 70.91,26.67 R18.1
  Bottom 0.152: U8.P$6 72.58,26.02 v72.08,26.52
D_P  (via drill 0.33)
  Top 0.152: J2.3 74.52,27.28 74.37,27.13 72.39,27.13 v72.08,27.43 71.78,27.13 71.32,27.13 71.17,27.28 70.91,27.28 R17.1
  Bottom 0.152: U8.P$1 72.58,27.93 v72.08,27.43
DQM0  (via drill 0.33)
  Top 0.152: v41.15,12.8 41.91,13.56 47.7,13.56 48.59,12.68 U7.49 | v17.98,11.73 17.37,12.34 12.34,12.34 10.52,14.17 10.52,24.69 12.75,26.93 U4.P$15
  Bottom 0.152: v41.15,12.8 40.39,12.04 18.29,12.04 v17.98,11.73
DQM1  (via drill 0.33)
  Top 0.152: U7.43 45.59,10.08 v45.11,9.6 | v36.42,9.6 35.81,9.6 34.44,8.23 30.02,8.23 29.11,7.32 22.86,7.32 19.05,11.12 17.68,11.12 16.76,12.04 12.19,12.04 8.99,15.24 8.99,16.76 9.6,17.37 9.6,22.55 4.43,27.73 U4.P$39
  Bottom 0.152: v45.11,9.6 v36.42,9.6
G0
  Top 0.152: U7.164 21.18,36.12 20.88,36.42 20.88,36.73 19.51,38.1 19.51,42.22 26.52,49.23 26.52,52.12 28.04,53.65 33.38,53.65 33.88,53.14 J9.P$18
G1
  Top 0.152: U7.162 20.94,37.12 19.81,38.25 19.81,42.06 23.47,45.72 29.87,45.72 30.88,46.73 J9.P$5
G2
  Top 0.152: U7.170 20.52,33.12 18.59,35.05 18.59,42.67 25.6,49.68 25.6,52.58 27.58,54.56 34.29,54.56 35.38,53.47 J9.P$24
G3
  Top 0.152: U7.176 20.47,30.12 19.81,30.79 19.81,33.38 18.29,34.9 18.29,42.82 25.3,49.84 25.3,52.73 27.43,54.86 34.59,54.86 35.88,53.58 J9.P$26
G4
  Top 0.152: U7.74 54.95,24.62 58.67,28.35 58.67,33.98 57,35.66 57,42.67 44.96,54.71 40.69,54.71 39.38,53.4 J9.P$40
G5
  Top 0.152: U7.76 55.19,25.62 58.37,28.8 58.37,33.83 56.69,35.51 56.69,42.52 44.81,54.41 41,54.41 39.88,53.29 J9.P$42
G6
  Top 0.152: U7.78 55.43,26.62 58.06,29.41 58.06,33.68 56.39,35.36 56.39,42.37 44.65,54.1 41.3,54.1 40.38,53.18 J9.P$44
G7
  Top 0.152: U7.80 55.66,27.62 57.76,29.72 57.76,33.53 56.08,35.2 56.08,42.22 44.5,53.8 41.6,53.8 40.88,53.08 J9.P$46
GND  (via drill 0.33, 3.05 pad 6.35)  (13 unrouted)
  Top 0.152: U7.93 53.8,34.12 v54.1,34.38 | U7.114 45.59,41.3 v45.13,40.84 | 35.09,13.38 v34.94,13.53 | U7.133 36.09,40.05 35.51,39.47 v32.46,39.47 | U7.63 v50.83,19.12 | U7.77 51.14,26.12 v51.05,26.21 | U7.200 v23.62,18.12 | v13.36,5.13 J6.P$3 | R30.1 R33.1 R29.1 R32.1 | U1.8 69.69,3.5 R27.1 | SW3.P$3 v26.34,2.11 SW3.P$4
  Top 0.254: U2.3 v67.51,16.61 68.01,17.11 U2.9
  Top 0.279: U7.22 35.09,13.38 | U7.33 40.59,9.11 v40.7,9 | U7.32 40.09,9.15 v39.94,9 | J9.P$47 41.38,47.62 | J9.P$49 41.88,47.62 | J9.P$48 41.38,52.97 | J9.P$50 41.88,52.97 | 41.38,50.16 41.38,48.84 | 41.88,50.16 41.88,48.84 | 41.38,50.41 41.38,51.44 | 41.88,50.41 41.88,51.44 | U7.189 v23.47,23.62
  Top 0.305: 17.37,64.2 R35.1
  Top 0.406: U3.2 17.37,64.2
  Top 0.762: v24.23,23.62 v23.47,23.62
  Top 1.016: v37.95,21.79 v37.95,19.66 | v37.95,34.9 v37.95,30.94 | v37.95,27.43 v37.95,24.08 | v37.03,21.79 v37.03,19.66 v38.86,19.66 v38.86,21.79 v37.03,21.79 | v37.03,34.9 v37.03,30.94 v38.86,30.94 v38.86,34.9 v37.03,34.9 | v37.03,27.43 v37.03,24.08 v38.86,24.08 v38.86,27.43 v37.03,27.43 | v31.09,37.8 v31.09,35.05 v32,35.05 v32,37.8 v31.09,37.8 | v43.74,36.42 v43.74,34.9 v44.65,34.9 v44.65,36.42 v43.74,36.42
  Bottom 0.152: R5.1 v13.36,5.13 | v26.34,2.11 C6.2
  Bottom 0.762: v23.47,23.62 v24.23,23.62
  other vias: 41.61,50.29 23.32,34.9 30.78,39.62 28.68,40.69 28.55,39.45 5.01,52.15 80.01,52.15 80.01,5.03 5.01,5.03 67.05,17.38 67.96,17.38 67.05,15.86 67.96,15.86
  pour Top (rank 6): 0,0 0,57.15 85.01,57.15 85.01,0
  pour Bottom (rank 6): 0,0 0,57.15 85.01,57.15 85.01,0
KEEPOUT
  cutout Top (no thermals): 66.34,18.8 68.63,18.8 68.63,14.46 66.34,14.46
  cutout Top (no thermals): 60.86,18.95 65.51,18.95 65.51,13.09 60.86,13.09
KEY_I2C_SCL  (via drill 0.33)
  Top 0.152: 32.09,40.77 v31.7,40.39 | R11.1 -5.44,42.47 v-5.28,42.62
  Bottom 0.152: J10.P$3 v-5.28,42.62 12.5,40.23 26.52,40.23 26.82,40.54 26.82,41 27.43,41.6 30.94,41.6 31.7,40.84 v31.7,40.39
KEY_I2C_SDA  (via drill 0.33)
  Top 0.152: 44.09,42.93 v43.59,43.43 | R12.1 -5.44,43.77 v-5.28,43.62
  Bottom 0.152: J10.P$2 v-5.28,43.62 13.04,40.69 24.54,40.69 26.06,42.22 41.3,42.22 42.52,43.43 v43.59,43.43
KEY_INT  (via drill 0.33)  (1 unrouted)
  Top 0.152: v49.53,19.04 50.14,18.44 51.21,18.44 51.52,18.12 U7.61 | -1.84,41.62 v-5.32,41.62
  Bottom 0.152: J10.P$4 v-5.32,41.62
LCD_DCLK
  Top 0.152: U7.150 27.59,43.28 28.5,44.2 30.63,44.2 33.38,46.95 J9.P$15
LCD_ENAB_M
  Top 0.152: U7.142 31.59,43.28 34.38,46.08 J9.P$19
LCD_FP
  Top 0.152: U7.144 30.59,43.28 33.88,46.58 J9.P$17
LCD_LE
  Top 0.152: U7.152 26.59,43.28 27.81,44.5 30.48,44.5 32.88,46.9 J9.P$13
LCD_LP
  Top 0.152: U7.140 32.59,43.28 34.88,45.58 J9.P$21
LCD_PWR
  Top 0.152: U7.154 25.59,43.28 27.11,44.81 30.33,44.81 32.38,46.86 J9.P$11
LED_A  (via drill 0.33)  (2 unrouted)
  Top 0.508: U3.5 v17.37,68.89
  Bottom 0.508: D1.C 15.54,68.89 v17.37,68.89 C16.1
LED_CTRL  (via drill 0.33)  (3 unrouted)
  Top 0.406: U3.4 v18.32,68.89
  Bottom 0.406: v18.32,68.89 18.75,68.46 R36.2
LED_K  (2 unrouted)
  Top 0.305: 18.32,64.17 R35.2
  Top 0.406: U3.3 18.32,64.17
N$1  (5 unrouted)
N$2  (via drill 0.33)
  Top 0.152: 71.89,5.74 C9.1 71.78,5.24 | VSYS.TP 74.07,5.54
  Top 0.254: U1.11 71.89,5.74 | U1.10 71.78,5.24
  Top 0.762: C9.1 v72.08,4.27
  Top 1.016: C9.1 74.07,5.54 74.36,5.54 PWR.P$2
  Bottom 0.152: v72.08,4.27 70.87,3.05 R26.1
  Bottom 0.254: PWR.P$2 80.77,13.87 79.1,15.54 77.61,15.54 | R24.2 77.61,15.54 | 77.61,15.54 R25.2
N$3  (via drill 0.33)
  Top 0.152: v67.67,3.05 67.67,4 U1.5
  Bottom 0.152: R26.2 v67.67,3.05
N$4
  Top 0.152: U1.6 68.18,3.42 68.39,3.21 R27.2
N$5  (via drill 0.33)
  Top 0.152: PGOOD.A v75.13,13.87
  Bottom 0.152: v75.13,13.87 R24.1
N$6  (via drill 0.33)
  Top 0.152: CHG.A v75.13,16.92
  Bottom 0.152: v75.13,16.92 R25.1
N$7  (via drill 0.33)
  Top 0.152: U1.7 68.68,3.41 69.04,3.05 69.04,1.52 69.34,1.22 v72.24,1.22 | 77.72,13.87 PGOOD.C v78.79,13.87
  Bottom 0.152: v78.79,13.87 78.79,12.5 75.74,9.75 75.74,4.72 v72.24,1.22
N$8  (via drill 0.33)
  Top 0.152: U1.9 70.55,4.74 v71.02,4.27 | v78.79,16.92 CHG.C
  Bottom 0.152: v71.02,4.27 71.02,7.47 74.22,10.67 74.22,17.37 74.98,18.14 78.18,18.14 78.79,17.53 v78.79,16.92
N$9  (via drill 0.33)
  Top 0.152: J3.2 56.24,8.98 56.22,8.99 | 56.24,10.52 56.22,10.5 J3.2 | 56.24,7.47 56.22,7.48 J3.2 | 65.23,5.74 arc90 C3.1
  Top 0.254: U1.3 65.27,5.24 C3.1 | U1.2 65.23,5.74
  Top 0.762: C3.1 63.91,5.43 v62.64,6.71 v62.64,8.69 v62.64,10.67 | 56.22,8.99 v55.02,8.99 | v55.02,10.52 56.24,10.52 | v55.02,7.47 56.24,7.47
  pour Bottom: 54.25,11.43 63.25,11.43 63.25,5.94 54.25,5.94
N$10
  Top 0.152: U1.1 66.29,6.25 65.13,7.42 TH1.2 R34.1
N$11
  Top 0.152: R29.2 67.67,8.38 68.18,7.87 U1.15
N$12
  Top 0.152: U1.12 70.09,6.24 70.41,6.55 70.41,8.34 R30.2
N$13
  Top 0.152: R32.2 66.6,8.38 67.06,7.92 67.36,7.92 67.68,7.61 U1.16
N$14
  Top 0.152: 69.23,15.87 U2.7 | 69.21,15.39 U2.6
  Top 1.016: PWR.P$3 80.03,15.87 79.55,15.39 69.21,15.39
  pour Top (rank 2, no thermals): 65.58,15.72 68.43,15.72 68.43,16.71 69.55,16.71 69.55,12.48 65.58,12.48
N$15
  Top 0.279: Y1.2 47.09,9.19 U7.46
  Top 0.305: Y1.2 C1.1
N$16
  Top 0.279: Y1.1 46.09,9.28 U7.44
  Top 0.305: Y1.1 C2.1
N$17  (via drill 0.33)
  Top 0.279: U7.20 34.09,13.53
  Top 0.3: 34.09,13.53 v34.06,13.59
  Bottom 0.3: v34.06,13.59 L4.2
  Bottom 0.406: L4.2 34.06,15.76 33.86,16.08 C14.1
N$18  (via drill 0.33)
  Top 0.279: U7.24 36.09,13.29
  Top 0.3: v35.91,13.59 35.91,13.47 36.09,13.29
  Bottom 0.3: v35.91,13.59 35.91,14.75 L5.2
  Bottom 0.406: L5.2 35.85,15.76 36.05,16.08 C15.1
N$19
  Top 0.152: R33.2 68.68,8.9 U1.14
N$20
  cutout Top: 25.3,14.78 49.53,14.78 49.53,38.86 25.3,38.86 25.3,15.39 25.91,15.39 25.91,38.25 48.77,38.25 48.77,15.39 25.3,15.39
N$21
  Top 0.152: Q1.3 R13.2
N$22
  Top 0.152: U7.69 54.99,22.12 55.47,21.64 R20.1
N$23  (via drill 0.33)
  Top 0.152: LED2.A v75.13,19.96
  Bottom 0.152: v75.13,19.96 R16.1
N$24  (via drill 0.33)
  Top 0.152: U7.45 v46.59,12.91 | v71.93,16.61 73.61,18.29 76.01,18.29 LED2.C
  Bottom 0.152: v46.59,12.91 47.09,13.41 68.73,13.41 v71.93,16.61
N$25  (via drill 0.33)
  Top 0.152: U7.202 19.71,17.12 v18.75,16.15
  Bottom 0.152: v18.75,16.15 16.76,14.17 13.87,14.17 10.21,17.83 8.99,17.83 8.23,17.07 8.23,15.09 9.3,14.02 9.3,11.68 J4.3
N$26  (via drill 0.33)
  Top 0.152: U7.204 v23.65,16.12
  Bottom 0.152: v23.65,16.12 23.62,16.09 23.62,14.94 21.95,13.26 14.33,13.26 10.06,17.53 9.14,17.53 8.53,16.92 8.53,15.24 9.6,14.17 9.6,10.74 J4.4
N$28  (via drill 0.33)
  Top 0.152: U4.P$36 v1.22,30.13
  Bottom 0.152: v1.22,30.13 R19.2
N$29
  Top 0.152: R20.2 57.34,21.57 Q1.1
N$30
  Top 0.152: 63.72,14.8 L1.1
  Top 0.254: U2.4 65.34,16.11 64.03,14.8 63.72,14.8
N$31
  Top 0.152: 63.49,17.11 L1.2
  Top 0.254: U2.2 63.49,17.11
N$33  (via drill 0.33)
  Top 0.559: U3.1 v15.54,65.4 13.41,65.4
  Top 0.61: 13.41,65.4 L2.2
  Bottom 0.406: v15.54,65.4 D1.A
N$35  (via drill 0.33)  (1 unrouted)
  Top 0.152: 68.63,49.33 70.71,47.24 70.71,44.65 v70.26,44.2 75.44,44.2 v80.92,38.71
  Bottom 0.152: U6.P$19 71.67,44.2 v70.26,44.2 69.03,44.2 C33.1 | R10.2 v80.92,38.71
N$36  (via drill 0.33)  (1 unrouted)
  Top 0.152: v69.8,46.79 67.63,48.95
  Bottom 0.152: U6.P$18 72.64,43.53 73.15,44.04 73.15,45.11 71.48,46.79 v69.8,46.79
N$37  (via drill 0.33)  (1 unrouted)
  Top 0.152: v70.26,42.22 69.65,42.82 69.65,44.5 70.41,45.26 70.41,47.09 68.13,49.37
  Bottom 0.152: U6.P$16 71.67,42.22 v70.26,42.22 69.02,42.22 C34.1
N$38  (via drill 0.33)  (1 unrouted)
  Top 0.152: v71.32,47.4 69.13,49.59
  Bottom 0.152: U6.P$15 71.71,41.6 72.85,41.6 73.46,42.22 73.46,45.26 v71.32,47.4
N$39
  Bottom 0.152: U6.P$2 R21.2
N$40
  Bottom 0.152: U6.P$5 80.45,42.23 81.23,41.45 R10.1
N$41
  Bottom 0.152: U6.P$4 R31.2
N$42  (via drill 0.33)
  Top 0.152: U7.42 45.09,10.49 43.59,8.99 v42.52,8.99
  Bottom 0.152: v42.52,8.99 R22.1
N$43
  Top 0.508: J2.1 73.01,25.68 L6.1
R0
  Top 0.152: U7.168 20.59,34.12 18.9,35.81 18.9,42.52 25.91,49.53 25.91,52.43 27.74,54.25 33.98,54.25 34.88,53.36 J9.P$22
R1
  Top 0.152: U7.166 20.5,35.12 19.2,36.42 19.2,42.37 26.21,49.38 26.21,52.27 27.89,53.95 33.68,53.95 34.38,53.25 J9.P$20
R2
  Top 0.152: U7.134 35.59,43.28 36.38,44.08 J9.P$27
R3
  Top 0.152: U7.132 36.59,43.28 36.88,43.58 J9.P$29
R4
  Top 0.152: U7.138 33.59,43.28 35.38,45.08 J9.P$23
R5
  Top 0.152: U7.136 34.59,43.28 35.88,44.58 J9.P$25
R6
  Top 0.152: U7.70 55.85,22.62 59.28,26.06 59.28,34.29 57.61,35.97 57.61,42.98 45.26,55.32 40.08,55.32 38.38,53.62 J9.P$36
R7
  Top 0.152: U7.72 54.71,23.62 58.98,27.89 58.98,34.14 57.3,35.81 57.3,42.82 45.11,55.02 40.39,55.02 38.88,53.51 J9.P$38
SCL  (2 unrouted)
SD_CLK  (via drill 0.33)  (2 unrouted)
  Top 0.152: U7.122 41.59,43.11 v42.52,44.04 | v63.55,39.78 U$3.CLK
  Bottom 0.152: v42.52,44.04 44.04,44.04 44.2,44.2 53.34,44.2 54.41,43.13 55.47,43.13
SD_CMD  (via drill 0.33)  (2 unrouted)
  Top 0.152: U7.120 42.59,43.28 v44.11,44.81 | v65.14,41.98 U$3.CMD
  Bottom 0.152: v44.11,44.81 53.34,44.81 54.41,43.74 55.47,43.74
SD_DAT_0  (via drill 0.33)  (2 unrouted)
  Top 0.152: U7.116 v44.59,43.59 | v64.25,37.58 U$3.DAT0
  Bottom 0.152: v44.59,43.59 53.34,43.59 54.41,42.52 55.47,42.52
SD_DAT_1  (via drill 0.33)  (2 unrouted)
  Top 0.152: U7.153 v26.09,40.87 | v64.67,36.48 U$3.DAT1
  Bottom 0.152: v26.09,40.87 27.13,41.91 41.45,41.91 42.37,42.82 44.81,42.82 44.96,42.98 53.34,42.98 54.41,41.91 55.47,41.91
SD_DAT_2  (via drill 0.33)  (2 unrouted)
  Top 0.152: U7.163 23.06,36.62 v23.32,36.88 | v66.12,44.18 U$3.DAT2
  Bottom 0.152: v23.32,36.88 26.82,36.88 27.89,35.81 34.29,35.81 40.08,41.6 41.6,41.6 42.52,42.52 53.03,42.52 54.25,41.3 55.47,41.3
SD_DAT_3  (via drill 0.33)  (2 unrouted)
  Top 0.152: v65.63,43.08 U$3.CD/DAT3 | U7.157 21.03,39.62 20.73,39.93 20.73,41 21.03,41.3 v21.64,41.3
  Bottom 0.152: v21.64,41.3 24.08,41.3 25.3,42.52 41.15,42.52 41.91,43.28 41.91,44.35 42.98,45.41 53.34,45.41 54.41,44.35 55.47,44.35
SD_DET  (via drill 0.33)  (1 unrouted)
  Top 0.152: U7.99 v54.1,37.12 | v79.05,33.48 U$3.DET_A
  Bottom 0.152: v54.1,37.12 62.79,39.17 | R14.2 v79.05,33.48
SD_PWR  (2 unrouted)
SDA  (2 unrouted)
SPI_CS  (1 unrouted)
TCK/SWDCLK  (via drill 0.33)
  Top 0.152: v13.36,8.69 J6.P$4 | v23.77,9.45 24.38,8.84 26.98,8.84 28.35,10.21 28.65,10.21 29.09,10.65 U7.10
  Bottom 0.152: v23.77,9.45 18.59,9.45 18.14,9.91 14.58,9.91 v13.36,8.69 R5.2
TDI  (via drill 0.33)
  Top 0.152: U7.4 26.09,9.93 v25.91,9.75 | J6.P$8 v15.9,8.69
  Bottom 0.152: v25.91,9.75 25.91,8.23 25.3,7.62 23.47,7.62 22.4,8.69 v15.9,8.69 R4.1
TDO/SWO  (via drill 0.33)
  Top 0.152: J6.P$6 v14.63,8.69 | v24.99,10.06 25.09,10.15 U7.2
  Bottom 0.152: v24.99,10.06 24.99,8.23 24.69,7.92 23.62,7.92 22.4,9.14 18.44,9.14 18.14,9.45 15.39,9.45 v14.63,8.69 R3.1
TMS/SWDIO  (via drill 0.33)
  Top 0.152: U7.6 27.09,10.32 v26.82,10.06 | J6.P$2 v12.09,8.69 12.85,9.45 17.07,9.45 v18.44,8.08
  Bottom 0.152: v26.82,10.06 26.82,8.08 26.06,7.32 23.32,7.32 22.55,8.08 v18.44,8.08 | R2.1 v12.09,8.69
TOUCH_INT  (via drill 0.33)  (1 unrouted)
  Top 0.152: U7.91 54.86,33.12 v55.17,33.43 | v72.72,37.64 v80.31,37.64
  Bottom 0.152: v80.31,37.64 80.31,39.17 79.85,39.63 U6.P$9
TRST  (via drill 0.33)
  Top 0.152: U7.8 28.09,12.91 v27.43,13.56
  Bottom 0.152: v27.43,13.56 R7.1
USB_D_N
  Top 0.152: U7.52 50.09,12.45 49.99,12.5 49.99,12.89 50.2,13.11 57.06,13.11 59.13,15.18 59.13,20.21 65.75,26.82 67.36,26.82 67.51,26.67 67.86,26.67 C18.1 68.39,26.67 69.04,26.67 69.3,26.41 R18.2
USB_D_P
  Top 0.152: U7.51 49.59,12.44 49.68,12.5 49.68,13.02 50.08,13.41 56.39,13.41 | 56.39,13.41 56.93,13.41 58.83,15.3 58.83,20.33 65.62,27.13 67.36,27.13 67.51,27.28 67.86,27.28 C17.1 68.39,27.28 69,27.28 R17.2 | R13.1 56.39,13.41

## Text on the board
bPlace: LPC1788 Board Rev 2 | Ryan Mamone 2014